# EAGLE design ALU_1 (EAGLE 5.11)
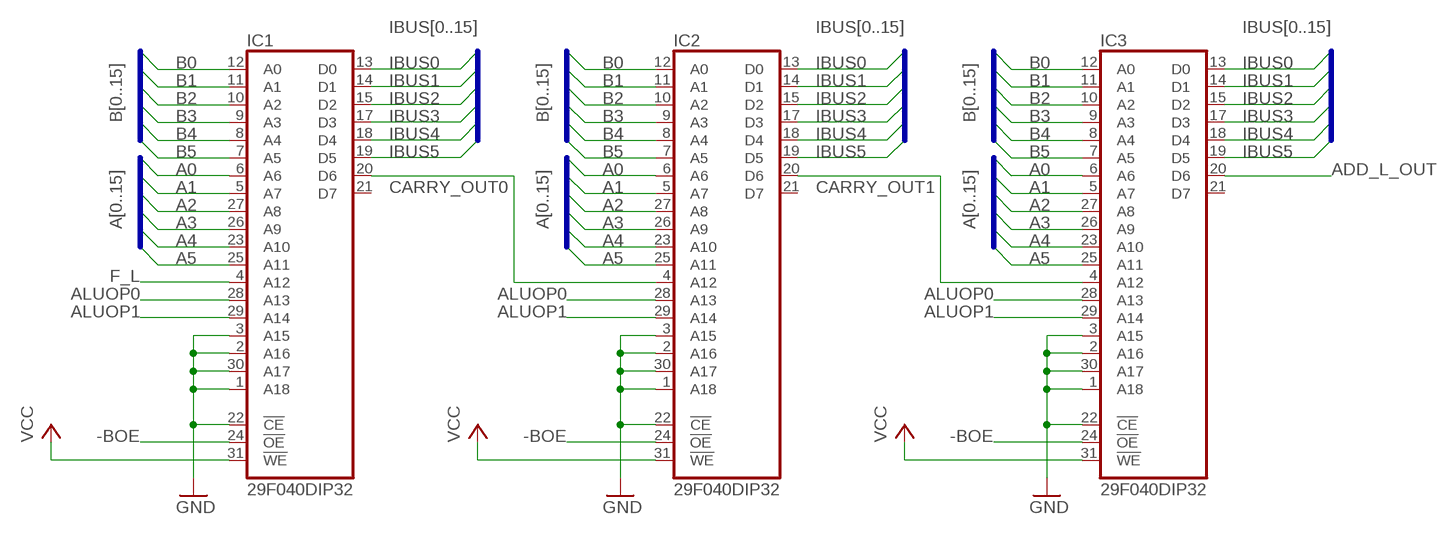
[diagram p0: schematic, sheet 1, part 1 of 2]
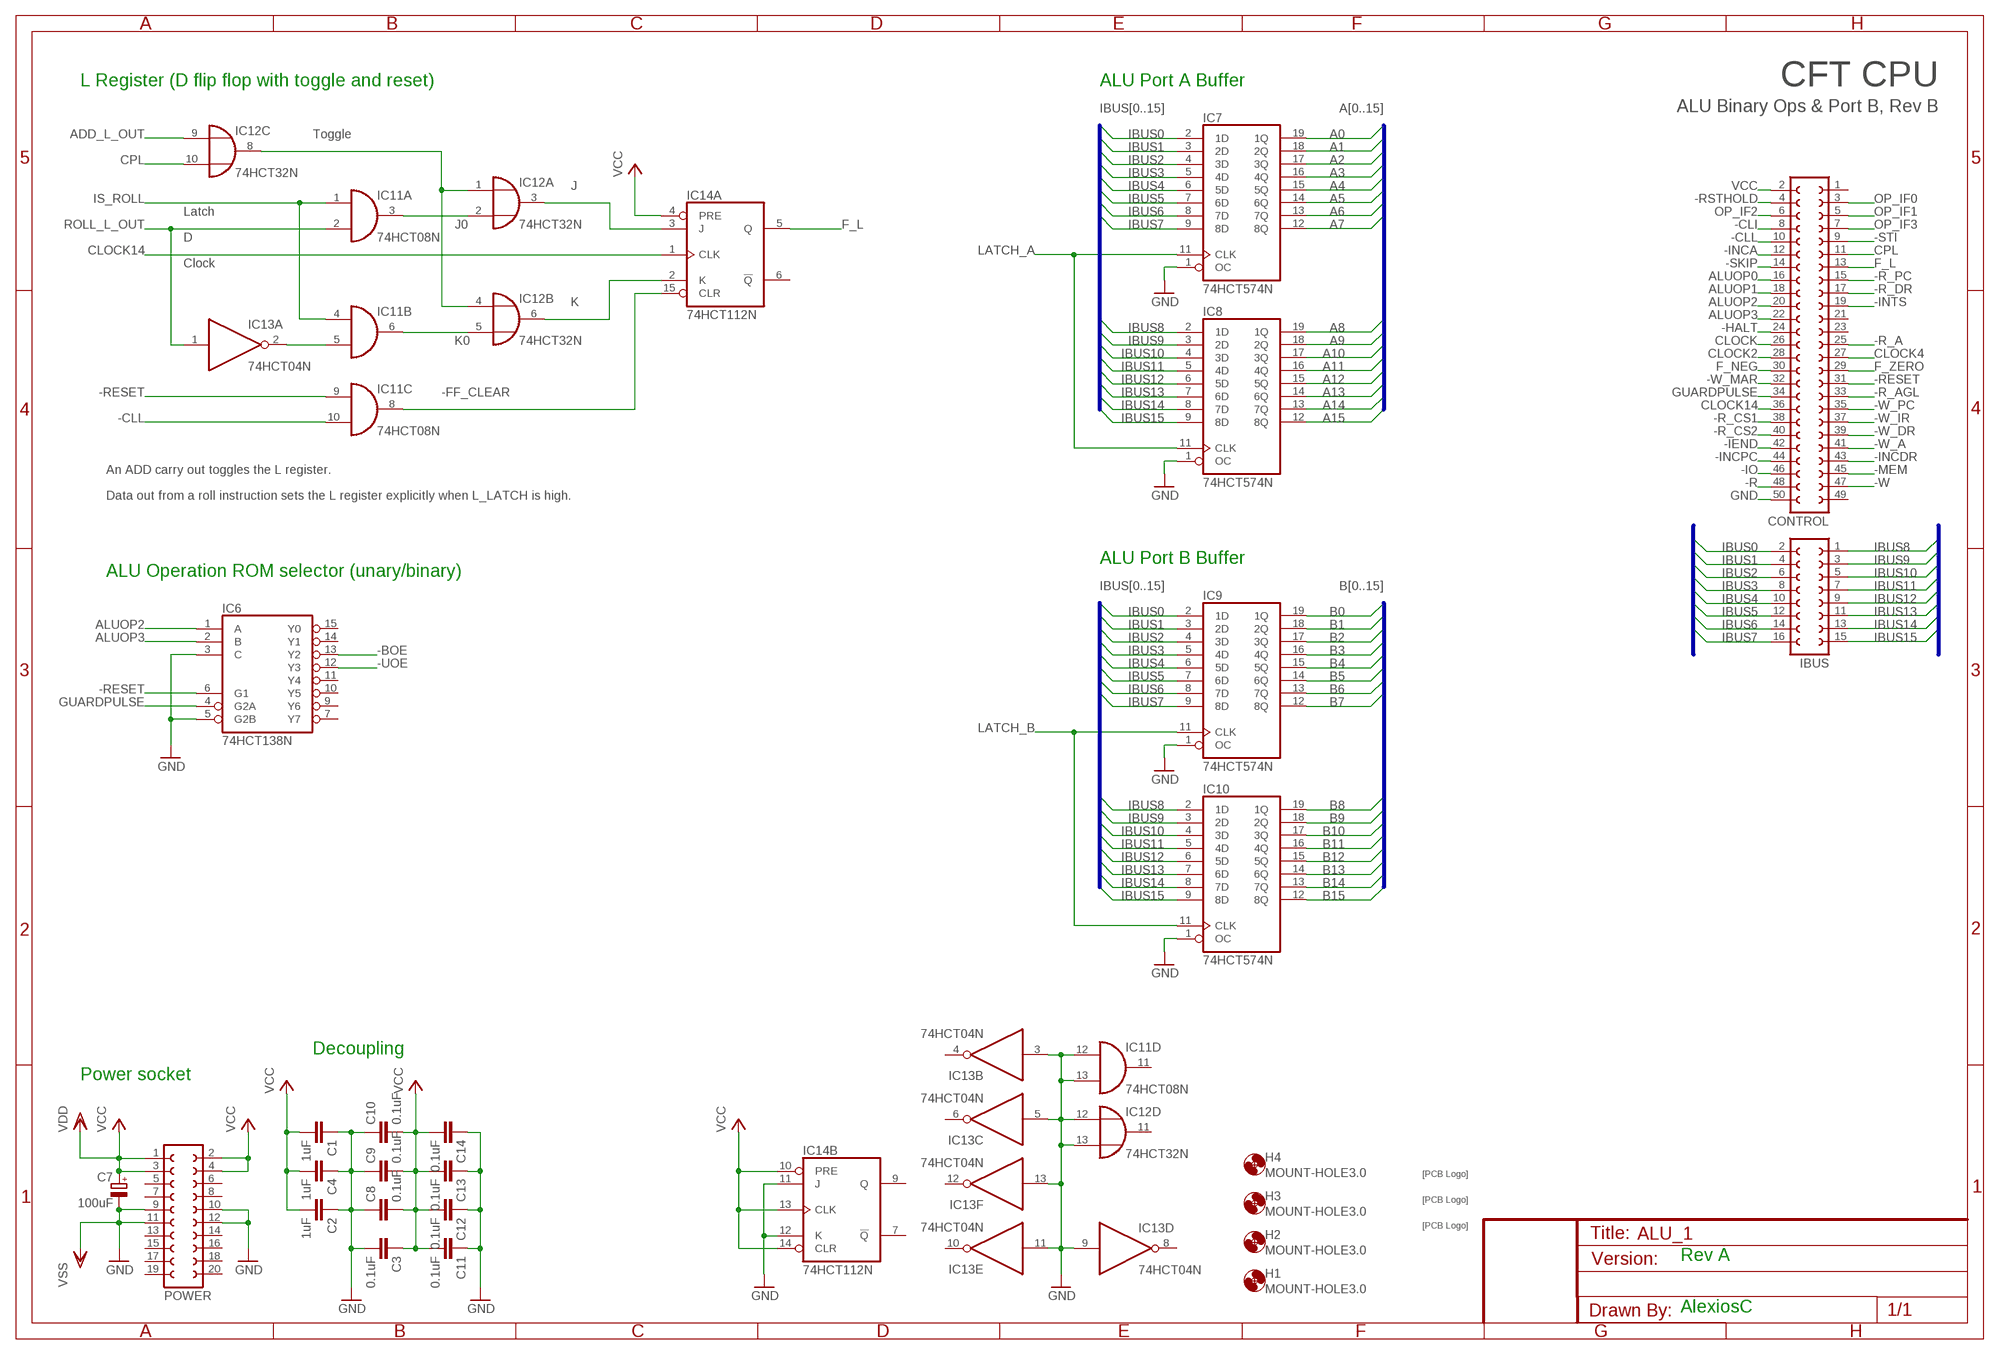
[diagram p1: schematic, sheet 1, part 2 of 2]

## Parts
C1  1uF  C-EU025-025X050  [C025-025X050]
C2  1uF  C-EU025-025X050  [C025-025X050]
C3  0.1uF  C-EU025-025X050  [C025-025X050]
C4  1uF  C-EU025-025X050  [C025-025X050]
C7  100uF  CPOL-EUE2.5-6  [E2,5-6]
C8  0.1uF  C-EU025-025X050  [C025-025X050]
C9  0.1uF  C-EU025-025X050  [C025-025X050]
C10  0.1uF  C-EU025-025X050  [C025-025X050]
C11  0.1uF  C-EU025-025X050  [C025-025X050]
C12  0.1uF  C-EU025-025X050  [C025-025X050]
C13  0.1uF  C-EU025-025X050  [C025-025X050]
C14  0.1uF  C-EU025-025X050  [C025-025X050]
CONTROL  FE25-2  [FE25-2]
H1  MOUNT-HOLE3.0  [3,0]
H2  MOUNT-HOLE3.0  [3,0]
H3  MOUNT-HOLE3.0  [3,0]
H4  MOUNT-HOLE3.0  [3,0]
IBUS  FE08-2  [FE08-2]
IC1  29F040DIP32  [DIL32]
IC2  29F040DIP32  [DIL32]
IC3  29F040DIP32  [DIL32]
IC6  74HCT138N  [DIL16]
IC7  74HCT574N  [DIL20]
IC8  74HCT574N  [DIL20]
IC9  74HCT574N  [DIL20]
IC10  74HCT574N  [DIL20]
IC11  74HCT08N  [DIL14]
IC12  74HCT32N  [DIL14]
IC13  74HCT04N  [DIL14]
IC14  74HCT112N  [DIL16]
POWER  FE10-2  [FE10-2]
U$1  SIGNATUREPLANE  [SIGNATURE_PLANE]
U$2  SIGNATUREPLANE  [SIGNATURE_PLANE]
U$3  SIGNATURESILK  [SIGNATURE]

## Nets
-BOE: IC1.24(!OE) IC2.24(!OE) IC3.24(!OE) IC6.13(Y2)
-CLI: CONTROL.8
-CLL: CONTROL.10 IC11.10(C:I1)
-FF_CLEAR: IC11.8(C:O) IC14.15(A:CLR)
-HALT: CONTROL.24
-IEND: CONTROL.42
-INCA: CONTROL.12
-INCDR: CONTROL.43
-INCPC: CONTROL.44
-INTS: CONTROL.19
-IO: CONTROL.46
-MEM: CONTROL.45
-R: CONTROL.48
-R_A: CONTROL.25
-R_AGL: CONTROL.33
-R_CS1: CONTROL.38
-R_CS2: CONTROL.40
-R_DR: CONTROL.17
-R_PC: CONTROL.15
-RESET: CONTROL.31 IC6.6(G1) IC11.9(C:I0)
-RSTHOLD: CONTROL.4
-SKIP: CONTROL.14
-STI: CONTROL.9
-UOE: IC6.12(Y3)
-W: CONTROL.47
-W_A: CONTROL.41
-W_DR: CONTROL.39
-W_IR: CONTROL.37
-W_MAR: CONTROL.32
-W_PC: CONTROL.35
A0: IC1.6(A6) IC2.6(A6) IC3.6(A6) IC7.19(1Q)
A1: IC1.5(A7) IC2.5(A7) IC3.5(A7) IC7.18(2Q)
A2: IC1.27(A8) IC2.27(A8) IC3.27(A8) IC7.17(3Q)
A3: IC1.26(A9) IC2.26(A9) IC3.26(A9) IC7.16(4Q)
A4: IC1.23(A10) IC2.23(A10) IC3.23(A10) IC7.15(5Q)
A5: IC1.25(A11) IC2.25(A11) IC3.25(A11) IC7.14(6Q)
A6: IC7.13(7Q)
A7: IC7.12(8Q)
A8: IC8.19(1Q)
A9: IC8.18(2Q)
A10: IC8.17(3Q)
A11: IC8.16(4Q)
A12: IC8.15(5Q)
A13: IC8.14(6Q)
A14: IC8.13(7Q)
A15: IC8.12(8Q)
ADD_L_OUT: IC3.20(D6) IC12.9(C:I0)
ALUOP0: CONTROL.16 IC1.28(A13) IC2.28(A13) IC3.28(A13)
ALUOP1: CONTROL.18 IC1.29(A14) IC2.29(A14) IC3.29(A14)
ALUOP2: CONTROL.20 IC6.1(A)
ALUOP3: CONTROL.22 IC6.2(B)
B0: IC1.12(A0) IC2.12(A0) IC3.12(A0) IC9.19(1Q)
B1: IC1.11(A1) IC2.11(A1) IC3.11(A1) IC9.18(2Q)
B2: IC1.10(A2) IC2.10(A2) IC3.10(A2) IC9.17(3Q)
B3: IC1.9(A3) IC2.9(A3) IC3.9(A3) IC9.16(4Q)
B4: IC1.8(A4) IC2.8(A4) IC3.8(A4) IC9.15(5Q)
B5: IC1.7(A5) IC2.7(A5) IC3.7(A5) IC9.14(6Q)
B6: IC9.13(7Q)
B7: IC9.12(8Q)
B8: IC10.19(1Q)
B9: IC10.18(2Q)
B10: IC10.17(3Q)
B11: IC10.16(4Q)
B12: IC10.15(5Q)
B13: IC10.14(6Q)
B14: IC10.13(7Q)
B15: IC10.12(8Q)
CARRY_OUT0: IC1.20(D6) IC2.4(A12)
CARRY_OUT1: IC2.20(D6) IC3.4(A12)
CLOCK: CONTROL.26
CLOCK2: CONTROL.28
CLOCK4: CONTROL.27
CLOCK14: CONTROL.36 IC14.1(A:CLK)
CPL: CONTROL.11 IC12.10(C:I1)
F_L: CONTROL.13 IC1.4(A12) IC14.5(A:Q)
F_NEG: CONTROL.30
F_ZERO: CONTROL.29
GND: C1.1 C2.1 C3.2 C4.1 C7.- C8.1 C9.1 C10.1 C11.1 C12.1 C13.1 C14.1 CONTROL.50 IC1.1(A18) IC1.2(A16) IC1.3(A15) IC1.22(!CE) IC1.30(A17) IC2.1(A18) IC2.2(A16) IC2.3(A15) IC2.22(!CE) IC2.30(A17) IC3.1(A18) IC3.2(A16) IC3.3(A15) IC3.22(!CE) IC3.30(A17) IC6.5(G2B) IC7.1(OC) IC8.1(OC) IC9.1(OC) IC10.1(OC) IC11.12(D:I0) IC11.13(D:I1) IC12.12(D:I0) IC12.13(D:I1) IC13.3(B:I) IC13.5(C:I) IC13.9(D:I) IC13.11(E:I) IC13.13(F:I) IC14.11(B:J) IC14.12(B:K) POWER.9 POWER.10 POWER.11 POWER.12 ; supply symbol labelled VSS
GUARDPULSE: CONTROL.34 IC6.4(G2A)
IBUS0: IBUS.2 IC1.13(D0) IC2.13(D0) IC3.13(D0) IC7.2(1D) IC9.2(1D)
IBUS1: IBUS.4 IC1.14(D1) IC2.14(D1) IC3.14(D1) IC7.3(2D) IC9.3(2D)
IBUS2: IBUS.6 IC1.15(D2) IC2.15(D2) IC3.15(D2) IC7.4(3D) IC9.4(3D)
IBUS3: IBUS.8 IC1.17(D3) IC2.17(D3) IC3.17(D3) IC7.5(4D) IC9.5(4D)
IBUS4: IBUS.10 IC1.18(D4) IC2.18(D4) IC3.18(D4) IC7.6(5D) IC9.6(5D)
IBUS5: IBUS.12 IC1.19(D5) IC2.19(D5) IC3.19(D5) IC7.7(6D) IC9.7(6D)
IBUS6: IBUS.14 IC7.8(7D) IC9.8(7D)
IBUS7: IBUS.16 IC7.9(8D) IC9.9(8D)
IBUS8: IBUS.1 IC8.2(1D) IC10.2(1D)
IBUS9: IBUS.3 IC8.3(2D) IC10.3(2D)
IBUS10: IBUS.5 IC8.4(3D) IC10.4(3D)
IBUS11: IBUS.7 IC8.5(4D) IC10.5(4D)
IBUS12: IBUS.9 IC8.6(5D) IC10.6(5D)
IBUS13: IBUS.11 IC8.7(6D) IC10.7(6D)
IBUS14: IBUS.13 IC8.8(7D) IC10.8(7D)
IBUS15: IBUS.15 IC8.9(8D) IC10.9(8D)
IS_ROLL: IC11.1(A:I0) IC11.4(B:I0)
J: IC12.3(A:O) IC14.3(A:J)
J0: IC11.3(A:O) IC12.2(A:I1)
K: IC12.6(B:O) IC14.2(A:K)
K0: IC11.6(B:O) IC12.5(B:I1)
L_TOGGLE: IC12.1(A:I0) IC12.4(B:I0) IC12.8(C:O)
LATCH_A: IC7.11(CLK) IC8.11(CLK)
LATCH_B: IC9.11(CLK) IC10.11(CLK)
N$1: IC11.5(B:I1) IC13.2(A:O)
N$4: IC6.3(C)
OP_IF0: CONTROL.3
OP_IF1: CONTROL.5
OP_IF2: CONTROL.6
OP_IF3: CONTROL.7
ROLL_L_OUT: IC11.2(A:I1) IC13.1(A:I)
VCC: C1.2 C2.2 C3.1 C4.2 C7.+ C8.2 C9.2 C10.2 C11.2 C12.2 C13.2 C14.2 CONTROL.2 IC1.31(!WE) IC2.31(!WE) IC3.31(!WE) IC14.4(A:PRE) IC14.10(B:PRE) IC14.13(B:CLK) IC14.14(B:CLR) POWER.1 POWER.2 POWER.3 POWER.4 ; supply symbol labelled VDD
Unconnected: CONTROL.1 CONTROL.21 CONTROL.23 CONTROL.49 IC1.21(D7) IC2.21(D7) IC3.21(D7) IC6.7(Y7) IC6.9(Y6) IC6.10(Y5) IC6.11(Y4) IC6.14(Y1) IC6.15(Y0) IC11.11(D:O) IC12.11(D:O) IC13.4(B:O) IC13.6(C:O) IC13.8(D:O) IC13.10(E:O) IC13.12(F:O) IC14.6(A:!Q) IC14.7(B:!Q) IC14.9(B:Q) POWER.5 POWER.6 POWER.7 POWER.8 POWER.13 POWER.14 POWER.15 POWER.16 POWER.17 POWER.18 POWER.19 POWER.20

## Buses
IBUS[0..15]
A[0..15]
B[0..15]

## Notes on the sheet
- L Register (D flip flop with toggle and reset) | ALU Port A Buffer | CFT CPU
- ALU Binary Ops & Port B, Rev B
- Toggle
- Latch
- D
- Clock
- An ADD carry out toggles the L register.
- Data out from a roll instruction sets the L register explicitly when L_LATCH is high.
- ALU Port B Buffer
- ALU Operation ROM selector (unary/binary)
- Decoupling
- Power socket
- Rev A
- AlexiosC

## Power pins joined to a net without a drawn wire
GND: IC1.16(GND) IC2.16(GND) IC3.16(GND) IC6.8(GND) IC7.10(GND) IC8.10(GND) IC9.10(GND) IC10.10(GND) IC11.7(P:GND) IC12.7(P:GND) IC13.7(P:GND) IC14.8(P:GND)
VCC: IC1.32(VCC) IC2.32(VCC) IC3.32(VCC) IC6.16(VCC) IC7.20(VCC) IC8.20(VCC) IC9.20(VCC) IC10.20(VCC) IC11.14(P:VCC) IC12.14(P:VCC) IC13.14(P:VCC) IC14.16(P:VCC)

## Library data of the parts
C1-C4 C8-C14 = rcl:C-EU: CAPACITOR, European symbol
C7 = rcl:CPOL-EU: POLARIZED CAPACITOR, European symbol
CONTROL = con-lsta:FE25-2: FEMALE HEADER
H1-H4 = holes:MOUNT-HOLE: MOUNTING HOLE with drill center marker
IBUS = con-lsta:FE08-2: FEMALE HEADER
IC1-IC3 = alexios:29F040: 4-mbit (512x8) Flash memory in a PLCC32 package (with socket). AM29F040 is an example of this.
IC6 = 74xx-eu:74*138: 3-line to 8-line DECODER/DEMULTIPLEXER
IC7-IC10 = 74xx-eu:74*574: 8-bit D type FLIP FLOP bus driver
IC11 = 74xx-eu:74*08: Quad 2-input AND gate
IC12 = 74xx-eu:74*32: Quad 2-input OR gate
IC13 = 74xx-eu:74*04: Hex INVERTER
IC14 = 74xx-eu:74*112: Dual J-K negative edge triggered FLIP FLOP, preset and clear
POWER = con-lsta:FE10-2: FEMALE HEADER; OC_FARNELL: unknown; OC_NEWARK: unknown
U$1-U$3 = alexios:SIGNATURE: Soup signature

## Net classes
1 Decoupling: width 1.27 mm

## Board
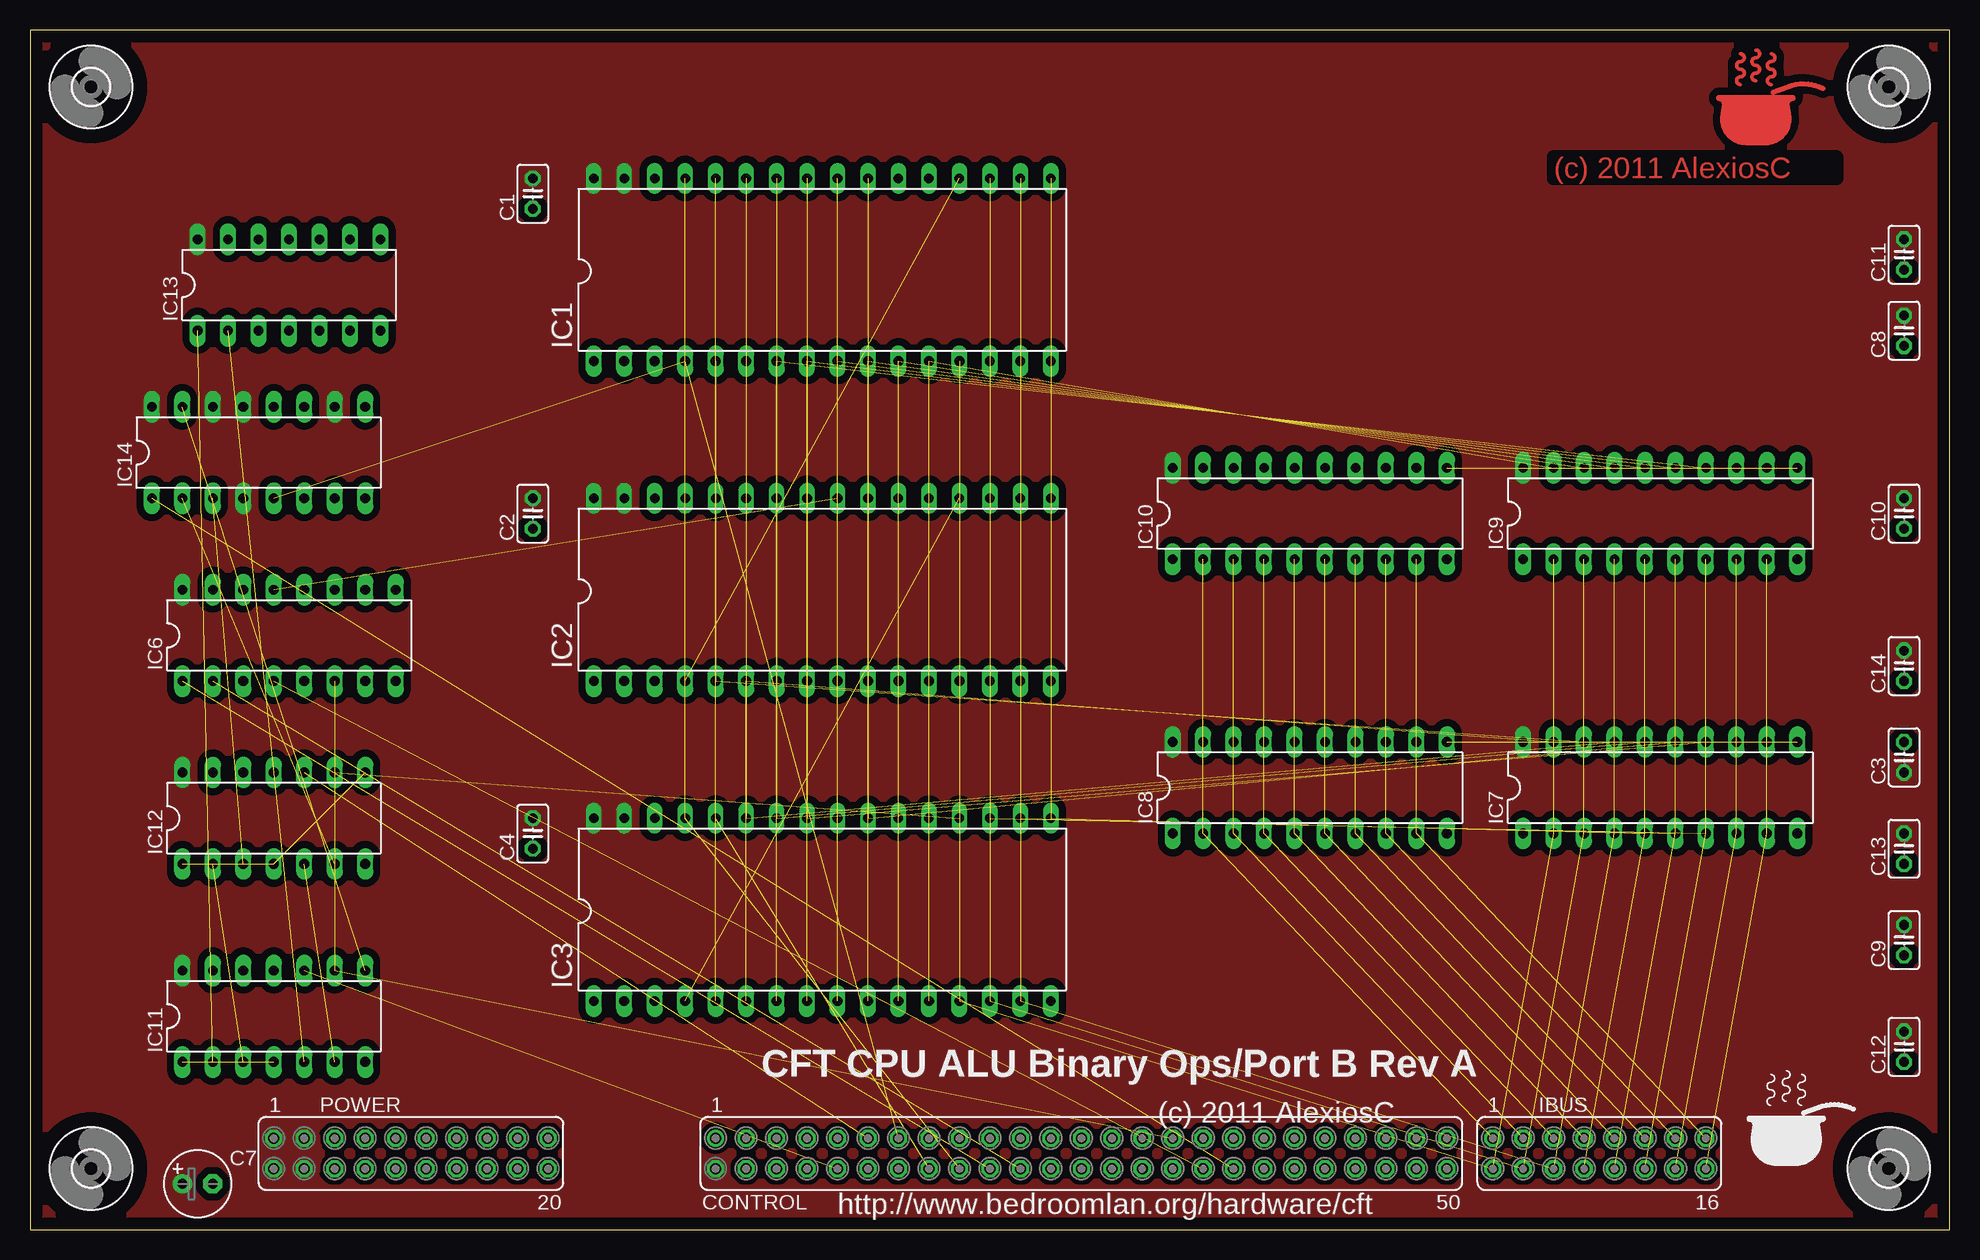
[diagram p2: board, top side]
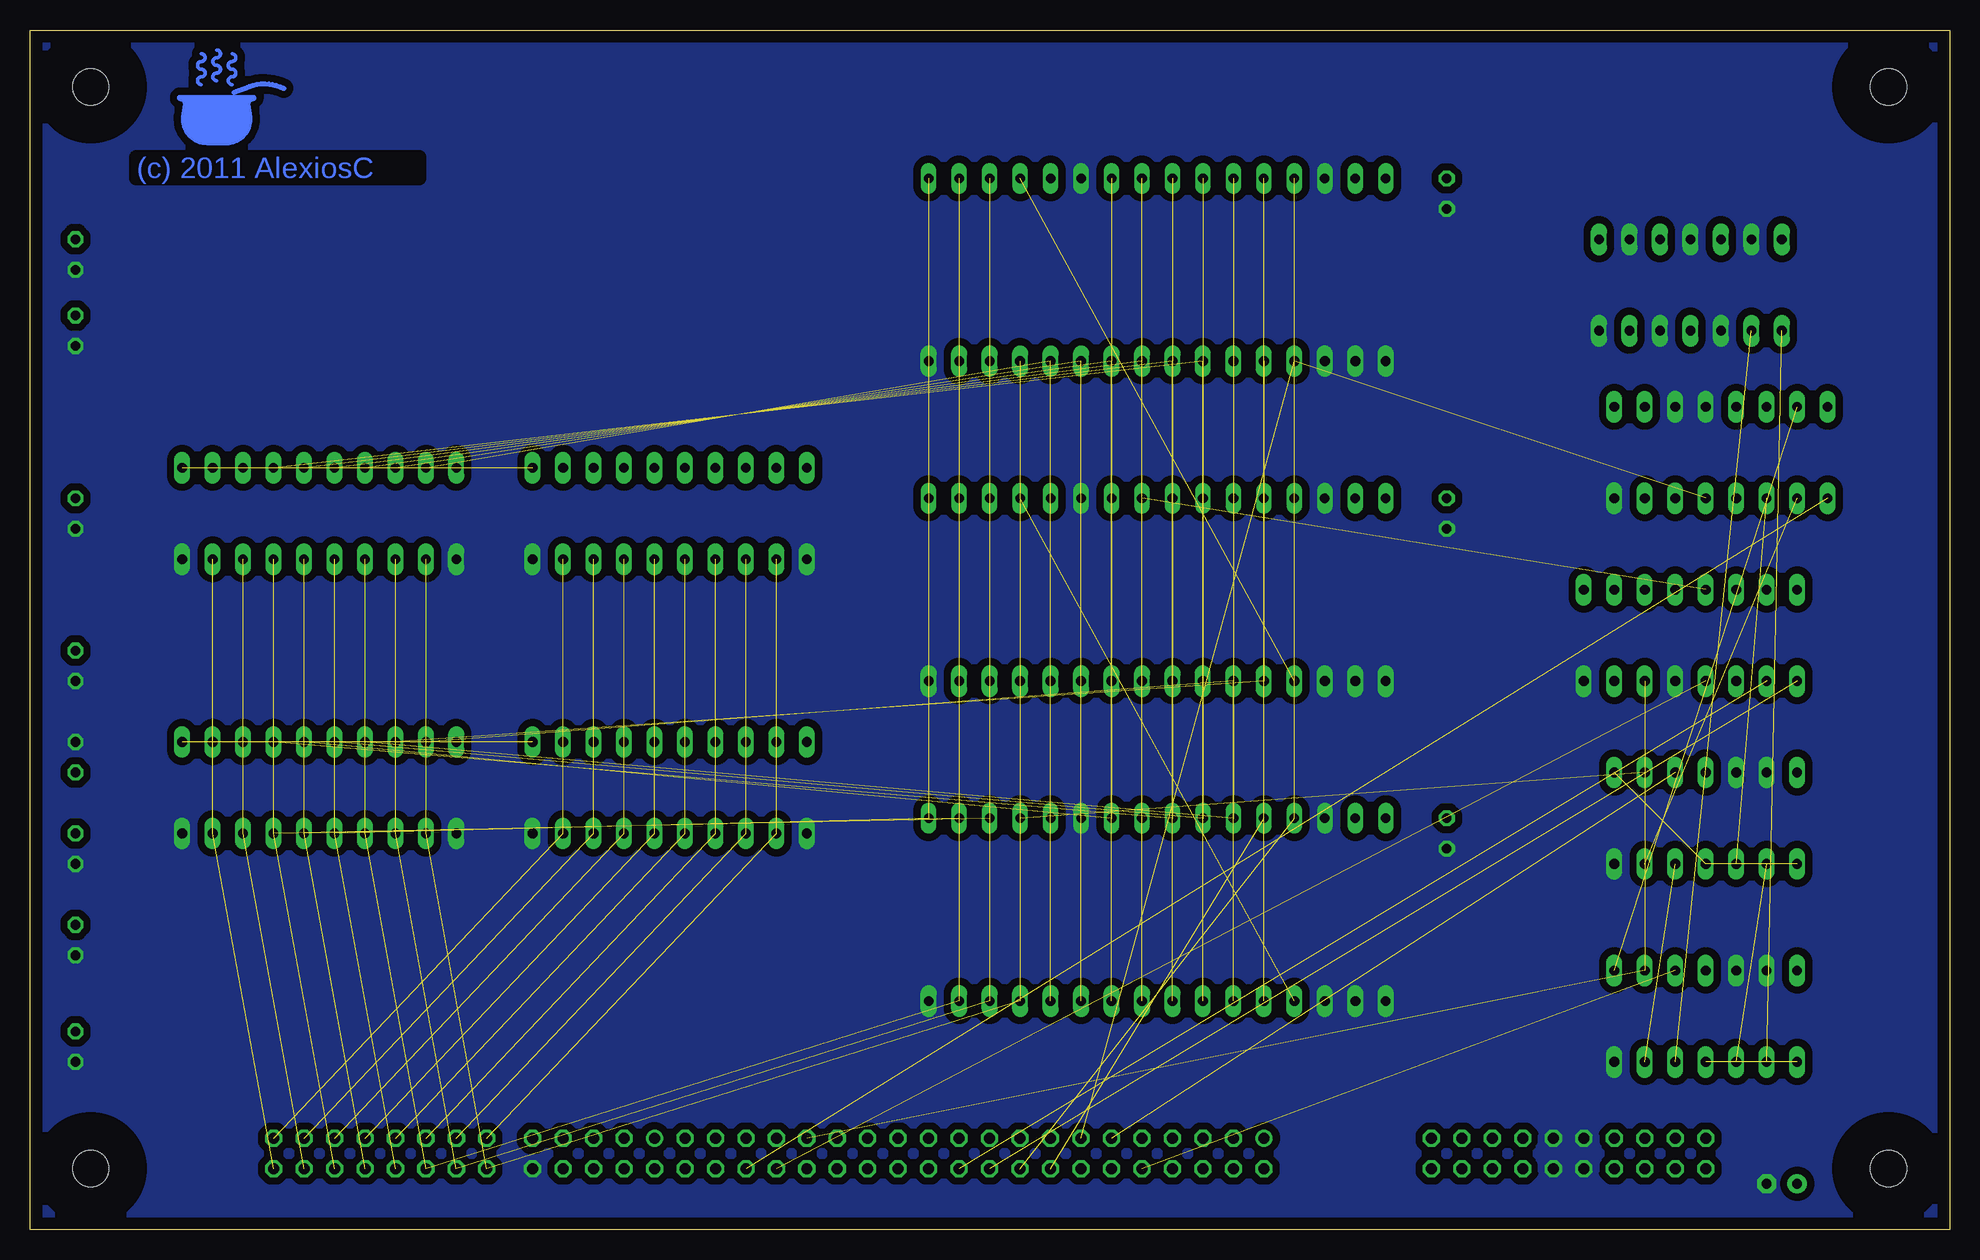
[diagram p3: board, bottom side, seen from below]

Size 160 x 100 mm. Coordinates in mm from the lower left corner, seen from the top.
Outline: 0,0 160,0 160,100 0,100 0,0
Copper layers (1*16): Top 0.035mm / dielectric 1.5mm / Bottom 0.035mm
Design rules "olimex-10mil": minimum track width 10mil, minimum drill 24mil, track to track 10mil, track to pad 10mil, pad to pad 10mil, via to via 10mil, smd to smd 10mil, copper to edge 40mil, drill to drill 10mil, minimum pad ring 10mil, minimum via ring 8mil, stop-mask expansion 0mil, vias tented up to drill 0mil, thermal gap 10mil

### Footprints (pad centres in the part's own frame; a part is rotated, then mirrored left to right if it is on the bottom)
C025-025X050 = drill 0.813 octagon: 1 -1.27,0; 2 1.27,0
E2,5-6 = drill 0.813 pad 1.6 round: + -1.27,0 | drill 0.813 pad 1.6 octagon: - 1.27,0
FE25-2 = drill 0.914 round: 1 -30.48,1.27; 41 20.32,1.27 | drill 0.914 octagon: 2 -30.48,-1.27; 3 -27.94,1.27; 4 -27.94,-1.27; 5 -25.4,1.27; 6 -25.4,-1.27; 7 -22.86,1.27; 8 -22.86,-1.27; 9 -20.32,1.27; 10 -20.32,-1.27; 11 -17.78,1.27; 12 -17.78,-1.27; 13 -15.24,1.27; 14 -15.24,-1.27; 15 -12.7,1.27; 16 -12.7,-1.27; 17 -10.16,1.27; 18 -10.16,-1.27; 19 -7.62,1.27; 20 -7.62,-1.27; 21 -5.08,1.27; 22 -5.08,-1.27; 23 -2.54,1.27; 24 -2.54,-1.27; 25 0,1.27; 26 0,-1.27; 27 2.54,1.27; 28 2.54,-1.27; 29 5.08,1.27; 30 5.08,-1.27; 31 7.62,1.27; 32 7.62,-1.27; 33 10.16,1.27; 34 10.16,-1.27; 35 12.7,1.27; 36 12.7,-1.27; 37 15.24,1.27; 38 15.24,-1.27; 39 17.78,1.27; 40 17.78,-1.27; 42 20.32,-1.27; 43 22.86,1.27; 44 22.86,-1.27; 45 25.4,1.27; 46 25.4,-1.27; 47 27.94,1.27; 48 27.94,-1.27; 49 30.48,1.27; 50 30.48,-1.27
3,0 = hole 3: 0,0
FE08-2 = drill 0.914 octagon: 1 -8.89,1.27; 2 -8.89,-1.27; 3 -6.35,1.27; 4 -6.35,-1.27; 5 -3.81,1.27; 6 -3.81,-1.27; 7 -1.27,1.27; 8 -1.27,-1.27; 9 1.27,1.27; 10 1.27,-1.27; 11 3.81,1.27; 12 3.81,-1.27; 13 6.35,1.27; 14 6.35,-1.27; 15 8.89,1.27; 16 8.89,-1.27
DIL32 = drill 0.813 long: 1 -19.05,-7.62; 2 -16.51,-7.62; 3 -13.97,-7.62; 4 -11.43,-7.62; 5 -8.89,-7.62; 6 -6.35,-7.62; 7 -3.81,-7.62; 8 -1.27,-7.62; 9 1.27,-7.62; 10 3.81,-7.62; 11 6.35,-7.62; 12 8.89,-7.62; 13 11.43,-7.62; 14 13.97,-7.62; 15 16.51,-7.62; 16 19.05,-7.62 | drill 0.8 long: 17 19.05,7.62; 18 16.51,7.62; 19 13.97,7.62; 20 11.43,7.62; 21 8.89,7.62; 22 6.35,7.62; 23 3.81,7.62; 24 1.27,7.62; 25 -1.27,7.62; 26 -3.81,7.62; 27 -6.35,7.62; 28 -8.89,7.62; 29 -11.43,7.62; 30 -13.97,7.62; 31 -16.51,7.62; 32 -19.05,7.62
DIL16 = drill 0.813 long: 1 -8.89,-3.81; 2 -6.35,-3.81; 3 -3.81,-3.81; 4 -1.27,-3.81; 5 1.27,-3.81; 6 3.81,-3.81; 7 6.35,-3.81; 8 8.89,-3.81; 9 8.89,3.81; 10 6.35,3.81; 11 3.81,3.81; 12 1.27,3.81; 13 -1.27,3.81; 14 -3.81,3.81; 15 -6.35,3.81; 16 -8.89,3.81
DIL20 = drill 0.813 long: 1 -11.43,-3.81; 2 -8.89,-3.81; 3 -6.35,-3.81; 4 -3.81,-3.81; 5 -1.27,-3.81; 6 1.27,-3.81; 7 3.81,-3.81; 8 6.35,-3.81; 9 8.89,-3.81; 10 11.43,-3.81; 11 11.43,3.81; 12 8.89,3.81; 13 6.35,3.81; 14 3.81,3.81; 15 1.27,3.81; 16 -1.27,3.81; 17 -3.81,3.81; 18 -6.35,3.81; 19 -8.89,3.81; 20 -11.43,3.81
DIL14 = drill 0.813 long: 1 -7.62,-3.81; 2 -5.08,-3.81; 3 -2.54,-3.81; 4 0,-3.81; 5 2.54,-3.81; 6 5.08,-3.81; 7 7.62,-3.81; 8 7.62,3.81; 9 5.08,3.81; 10 2.54,3.81; 11 0,3.81; 12 -2.54,3.81; 13 -5.08,3.81; 14 -7.62,3.81
FE10-2 = drill 0.914 octagon: 1 -11.43,1.27; 2 -11.43,-1.27; 3 -8.89,1.27; 4 -8.89,-1.27; 5 -6.35,1.27; 6 -6.35,-1.27; 7 -3.81,1.27; 8 -3.81,-1.27; 9 -1.27,1.27; 10 -1.27,-1.27; 11 1.27,1.27; 12 1.27,-1.27; 13 3.81,1.27; 14 3.81,-1.27; 15 6.35,1.27; 16 6.35,-1.27; 17 8.89,1.27; 18 8.89,-1.27; 19 11.43,1.27; 20 11.43,-1.27

### Placement (x,y rotation side)
C1  41.91,86.36 90 top
C2  41.91,59.69 90 top
C3  156.21,39.37 90 top
C4  41.91,33.02 90 top
C7  13.97,3.81 0 top
C8  156.21,74.93 90 top
C9  156.21,24.13 90 top
C10  156.21,59.69 90 top
C11  156.21,81.28 90 top
C12  156.21,15.24 90 top
C13  156.21,31.75 90 top
C14  156.21,46.99 90 top
CONTROL  87.63,6.35 0 top
H1  154.94,95.25 0 top
H2  154.94,5.08 0 top
H3  5.08,5.08 0 top
H4  5.08,95.25 0 top
IBUS  130.81,6.35 0 top
IC1  66.04,80.01 0 top
IC2  66.04,53.34 0 top
IC3  66.04,26.67 0 top
IC6  21.59,49.53 0 top
IC7  135.89,36.83 0 top
IC8  106.68,36.83 0 top
IC9  135.89,59.69 0 top
IC10  106.68,59.69 0 top
IC11  20.32,17.78 0 top
IC12  20.32,34.29 0 top
IC13  21.59,78.74 0 top
IC14  19.05,64.77 0 top
POWER  31.75,6.35 0 top
U$1  140.97,90.17 0 top
U$2  147.32,90.17 0 bottom
U$3  143.51,5.08 0 top

### Tracks (layer width: path | path; a pad name or v marks a point on that pad's centre or on a via)
-BOE  (3 unrouted)
-CLL  (1 unrouted)
-FF_CLEAR  (1 unrouted)
-RESET  (2 unrouted)
A0  (3 unrouted)
A1  (3 unrouted)
A2  (3 unrouted)
A3  (3 unrouted)
A4  (3 unrouted)
A5  (3 unrouted)
ADD_L_OUT  (1 unrouted)
ALUOP0  (3 unrouted)
ALUOP1  (3 unrouted)
ALUOP2  (1 unrouted)
ALUOP3  (1 unrouted)
B0  (3 unrouted)
B1  (3 unrouted)
B2  (3 unrouted)
B3  (3 unrouted)
B4  (3 unrouted)
B5  (3 unrouted)
CARRY_OUT0  (1 unrouted)
CARRY_OUT1  (1 unrouted)
CLOCK14  (1 unrouted)
CPL  (1 unrouted)
F_L  (2 unrouted)
GND
  pour Bottom (isolate 0.508, no thermals): 30.48,8.89 29.21,7.62 29.21,5.08 30.48,3.81 33.02,3.81 34.29,5.08 34.29,7.62 33.02,8.89
  pour Bottom (isolate 0.61, no thermals): 0,100.33 0,0 160.02,0 160.02,100.33
GUARDPULSE  (1 unrouted)
IBUS0  (5 unrouted)
IBUS1  (5 unrouted)
IBUS2  (5 unrouted)
IBUS3  (5 unrouted)
IBUS4  (5 unrouted)
IBUS5  (5 unrouted)
IBUS6  (2 unrouted)
IBUS7  (2 unrouted)
IBUS8  (2 unrouted)
IBUS9  (2 unrouted)
IBUS10  (2 unrouted)
IBUS11  (2 unrouted)
IBUS12  (2 unrouted)
IBUS13  (2 unrouted)
IBUS14  (2 unrouted)
IBUS15  (2 unrouted)
IS_ROLL  (1 unrouted)
J  (1 unrouted)
J0  (1 unrouted)
K  (1 unrouted)
K0  (1 unrouted)
L_TOGGLE  (2 unrouted)
LATCH_A  (1 unrouted)
LATCH_B  (1 unrouted)
N$1  (1 unrouted)
ROLL_L_OUT  (1 unrouted)
VCC
  pour Top (isolate 0.508, no thermals): 20.32,8.89 19.05,7.62 19.05,5.08 20.32,3.81 22.86,3.81 24.13,5.08 24.13,7.62 22.86,8.89
  pour Top (isolate 0.61, rank 6, no thermals): 0,100.33 0,0 160.02,0 160.02,100.33

### Text on the board
Top: (c) 2011 AlexiosC
Bottom: (c) 2011 AlexiosC
tNames: CFT CPU ALU Binary Ops/Port B Rev A | (c) 2011 AlexiosC | http://www.bedroomlan.org/hardware/cft
tValues: +12V | +5V | GND